# Altium schematic sheet YD-ESP32-S3.SchDoc
size 420 x 297 mm
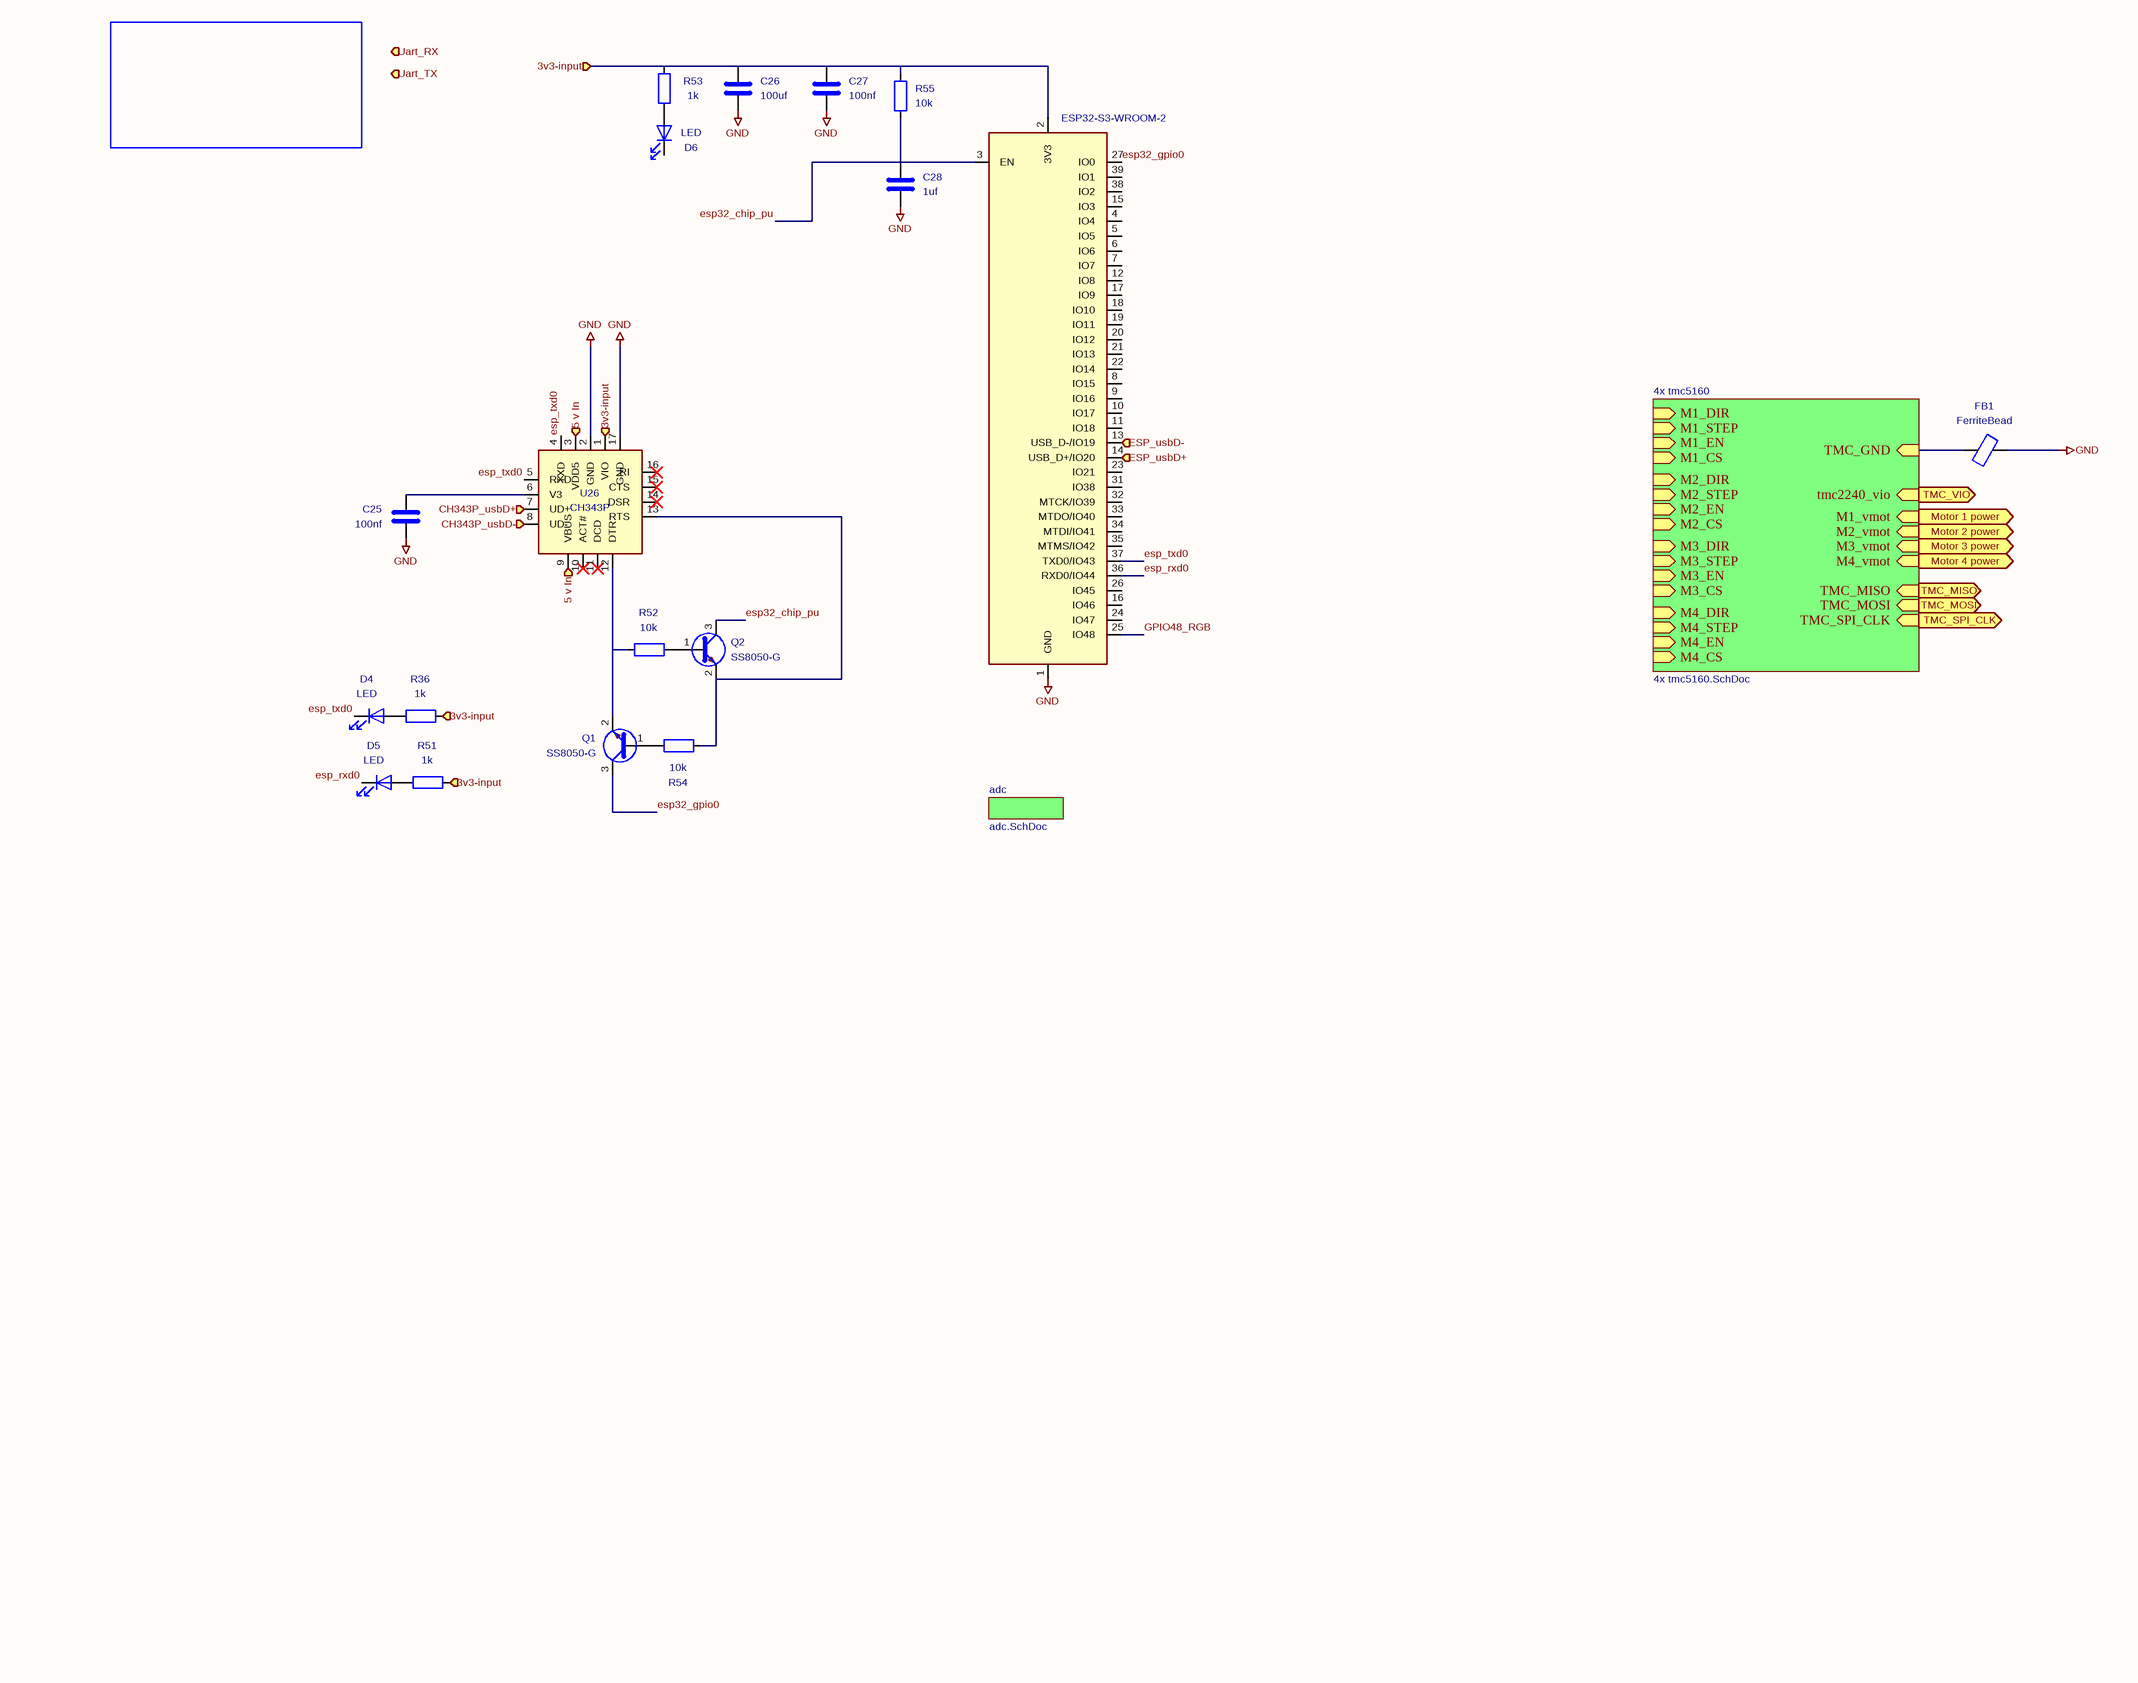
[diagram p0: YD-ESP32-S3.SchDoc]

## Parts
C25  100nf  [C_0805_2012Metric]
C26  100uf  [C_0805_2012Metric]
C27  100nf  [C_0805_2012Metric]
C28  1uf  [C_0805_2012Metric]
D4  LED  [LED_Lumex_SML-LX0303SIUPGUSB]
D5  LED  [LED_Lumex_SML-LX0303SIUPGUSB]
D6  LED  [LED_Lumex_SML-LX0303SIUPGUSB]
FB1  FerriteBead
Q1  SS8050-G  [TO-18-3_Lens]
Q2  SS8050-G  [TO-18-3_Lens]
R36  1k  [R_0805_2012Metric_Pad1.20x1.40mm_HandSolder]
R51  1k  [R_0805_2012Metric_Pad1.20x1.40mm_HandSolder]
R52  10k  [R_0805_2012Metric_Pad1.20x1.40mm_HandSolder]
R53  1k  [R_0805_2012Metric_Pad1.20x1.40mm_HandSolder]
R54  10k  [R_0805_2012Metric_Pad1.20x1.40mm_HandSolder]
R55  10k  [R_0805_2012Metric_Pad1.20x1.40mm_HandSolder]
U26  CH343P  [QFN-16-1EP_3x3mm_P0.5mm_EP1.7x1.7mm_ThermalVias]
U27  ESP32-S3-WROOM-2  [ESP32-S3-WROOM-2]

## Sub-sheets
4x tmc5160 = 4x tmc5160.SchDoc: M3_vmot (in), TMC_MISO (in), TMC_SPI_CLK (in), TMC_MOSI (in), M1_EN (in), M1_DIR (in), M1_STEP (in), M1_CS (in), tmc2240_vio (in), M2_STEP (in), M2_DIR (in), M2_vmot (in), M2_EN (in), M2_CS (in), M1_vmot (in), M3_EN (in), M3_CS (in), M3_STEP (in), M3_DIR (in), M4_vmot (in), M4_EN (in), M4_CS (in), M4_STEP (in), M4_DIR (in), TMC_GND (in)
adc = adc.SchDoc: no entries

## Ports
3v3-input (in), 5 v In (in), CH343P_usbD+ (in), CH343P_usbD- (in), ESP_usbD+ (in), ESP_usbD- (in), Motor 1 power (in), Motor 2 power (in), Motor 3 power (in), Motor 4 power (in), TMC_MISO (in), TMC_MOSI (in), TMC_SPI_CLK (in), TMC_VIO (in), Uart_RX (in), Uart_TX (in)

## Nets
GND: C25.2 C26.2 C27.2 C28.2 FB1.2 U26.2(GND) U26.17(GND) U27.1(GND)
3v3-input: C26.1 C27.1 R36.2 R51.2 R53.2 R55.2 U26.1(VIO) U27.2(3V3) ; port 3v3-input
5 v In: U26.3(VDD5) U26.9(VBUS) ; port 5 v In
CH343P_usbD+: U26.7(UD+) ; port CH343P_usbD+
CH343P_usbD-: U26.8(UD-) ; port CH343P_usbD-
esp32_chip_pu: C28.1 Q2.3(C) R55.1 U27.3(EN)
esp32_gpio0: Q1.3(C) U27.27(IO0)
esp_rxd0: D5.1(K) U27.36(RXD0/IO44)
esp_txd0: D4.1(K) U26.4(TXD) U26.5(RXD) U27.37(TXD0/IO43)
ESP_usbD+: U27.14(USB_D+/IO20) ; port ESP_usbD+
ESP_usbD-: U27.13(USB_D-/IO19) ; port ESP_usbD-
GPIO48_RGB: U27.25(IO48)
Motor 1 power: port Motor 1 power, sheet 4x tmc5160/M1_vmot
Motor 2 power: port Motor 2 power, sheet 4x tmc5160/M2_vmot
Motor 3 power: port Motor 3 power, sheet 4x tmc5160/M3_vmot
Motor 4 power: port Motor 4 power, sheet 4x tmc5160/M4_vmot
TMC_MISO: port TMC_MISO, sheet 4x tmc5160/TMC_MISO
TMC_MOSI: port TMC_MOSI, sheet 4x tmc5160/TMC_MOSI
TMC_SPI_CLK: port TMC_SPI_CLK, sheet 4x tmc5160/TMC_SPI_CLK
TMC_VIO: port TMC_VIO, sheet 4x tmc5160/tmc2240_vio
NetC25_1: C25.1 U26.6(V3)
NetD4_2: D4.2(A) R36.1
NetD5_2: D5.2(A) R51.1
NetD6_2: D6.2(A) R53.1
NetFB1_1: FB1.1 ; sheet 4x tmc5160/TMC_GND
NetQ1_1: Q1.1(B) R54.1
NetQ1_2: Q1.2(E) R52.1 U26.12(DTR)
NetQ2_1: Q2.1(B) R52.2
NetQ2_2: Q2.2(E) R54.2 U26.13(RTS)

Not connected (* = marked no-connect by the designer): D6 1(K); U26 10(ACT#)* 11(DCD)* 14(DSR)* 15(CTS)* 16(RI)*; U27 4(IO4) 5(IO5) 6(IO6) 7(IO7) 8(IO15) 9(IO16) 10(IO17) 11(IO18) 12(IO8) 15(IO3) 16(IO46) 17(IO9) 18(IO10) 19(IO11) 20(IO12) 21(IO13) 22(IO14) 23(IO21) 24(IO47) 26(IO45) 28(NC) 29(NC) 30(NC) 31(IO38) 32(MTCK/IO39) 33(MTDO/IO40) 34(MTDI/IO41) 35(MTMS/IO42) 38(IO2) 39(IO1) 40(GND) 41(GND)

## Notes on the sheet
- 1
- 2
- 3
- 4
- 5
- 6
- 7
- 8
- A
- B
- C
- D
- E
- Title:
- File: YD-ESP32-S3.kicad_sch
- Sheet: /
- F
- KiCad E.D.A.  kicad (5.1.4)-1
- Size: A3
- Date:
- Rev:
- Id: 1/1

## Library data of the parts
C25-C28 = C: Description: Unpolarized capacitor; Footprint: Capacitor_SMD:C_0805_2012Metric
  C25 C27: Value: 100nf
  C26: Value: 100uf
  C28: Value: 1uf
D4-D6 = LED: Description: Light emitting diode; Value: LED; Footprint: LED_SMD:LED_Lumex_SML-LX0303SIUPGUSB
Q1 Q2 = BC817: Description: 0.8A Ic, 45V Vce, NPN Transistor, SOT-23; Value: SS8050-G; Footprint: Package_TO_SOT_THT:TO-18-3_Lens
R36 R51-R55 = R: Description: Resistor; Footprint: Resistor_SMD:R_0805_2012Metric_Pad1.20x1.40mm_HandSolder
  R36 R51 R53: Value: 1k
  R52 R54 R55: Value: 10k
U27 = ESP32-S3-WROOM-2: Description: RF Module, 2.4 GHz, Wi­-Fi, Bluetooth, BLE, ESP32­-S3R8V; Value: ESP32-S3-WROOM-2; Footprint: RF_Module:ESP32-S3-WROOM-2
FB1 = FerriteBead: Description: Ferrite bead; Value: FerriteBead
U26 = CH343P: Value: CH343P; Footprint: Package_DFN_QFN:QFN-16-1EP_3x3mm_P0.5mm_EP1.7x1.7mm_ThermalVias